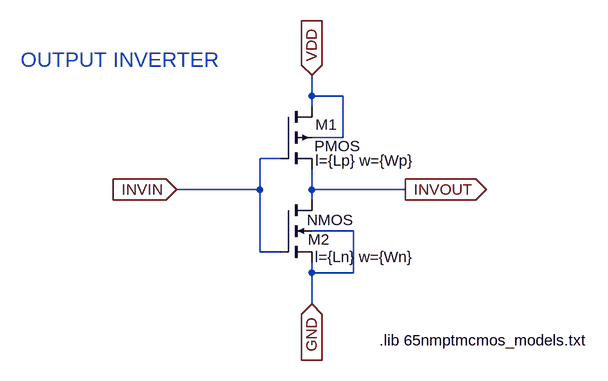
[diagram p0: schematic Inv.asc]
Inv.asc, the LTspice schematic file:
Version 4
SHEET 1 880 680
WIRE 224 16 224 -16
WIRE 272 16 224 16
WIRE 224 32 224 16
WIRE 272 80 272 16
WIRE 272 80 224 80
WIRE 176 112 144 112
WIRE 144 160 144 112
WIRE 144 160 16 160
WIRE 224 160 224 128
WIRE 368 160 224 160
WIRE 224 176 224 160
WIRE 288 224 224 224
WIRE 144 256 144 160
WIRE 176 256 144 256
WIRE 224 288 224 272
WIRE 288 288 288 224
WIRE 288 288 224 288
WIRE 224 336 224 288
FLAG 224 -16 VDD
IOPIN 224 -16 In
FLAG 224 336 GND
IOPIN 224 336 In
FLAG 16 160 INVIN
IOPIN 16 160 In
FLAG 368 160 INVOUT
IOPIN 368 160 Out
SYMBOL pmos4 176 32 R0
WINDOW 123 54 83 Left 2
WINDOW 0 54 28 Left 2
WINDOW 3 52 61 Left 2
SYMATTR Value2 l={Lp} w={Wp}
SYMATTR InstName M1
SYMBOL nmos4 176 176 R0
WINDOW 123 53 88 Left 2
WINDOW 0 42 61 Left 2
WINDOW 3 41 31 Left 2
SYMATTR Value2 l={Ln} w={Wn}
SYMATTR InstName M2
TEXT 328 392 Left 2 !.lib 65nmptmcmos_models.txt
TEXT -224 -40 Left 3 ;OUTPUT INVERTER

The netlist it stands for:
* Inv.asc
M1 VDD INVIN INVOUT VDD PMOS l={Lp} w={Wp}
M2 INVOUT INVIN GND GND NMOS l={Ln} w={Wn}
.model NMOS NMOS
.model PMOS PMOS
.lib standard.mos
.lib 65nmptmcmos_models.txt
* OUTPUT INVERTER
.backanno
.end